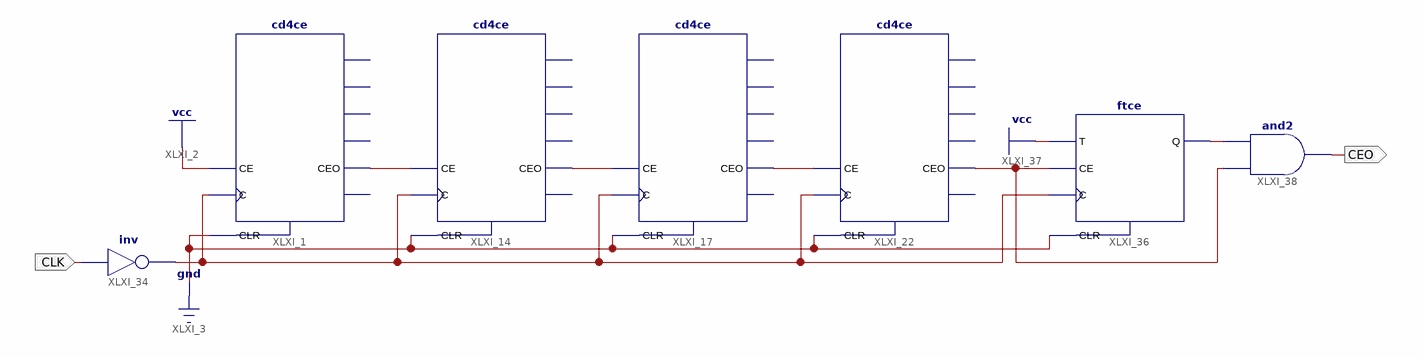
[diagram p0: schematic sheet 1]
// Xilinx ISE schematic clkdiv20k.sch (spartan6) as structural Verilog: 7 symbols, 2 ports
module clkdiv20k (
  input  CLK,
  output CEO
);

  wire CLK_I, XLXN_14, XLXN_27, XLXN_37, XLXN_45, XLXN_50;

  cd4ce XLXI_1 (.C(CLK_I), .CE(1'b1), .CLR(1'b0), .CEO(XLXN_14));  // open: Q0, Q1, Q2, Q3, TC
  cd4ce XLXI_14 (.C(CLK_I), .CE(XLXN_14), .CLR(1'b0), .CEO(XLXN_27));  // open: Q0, Q1, Q2, Q3, TC
  cd4ce XLXI_17 (.C(CLK_I), .CE(XLXN_27), .CLR(1'b0), .CEO(XLXN_37));  // open: Q0, Q1, Q2, Q3, TC
  cd4ce XLXI_22 (.C(CLK_I), .CE(XLXN_37), .CLR(1'b0), .CEO(XLXN_45));  // open: Q0, Q1, Q2, Q3, TC
  not XLXI_34 (CLK_I, CLK);
  ftce XLXI_36 (.C(CLK_I), .CE(XLXN_45), .CLR(1'b0), .T(1'b1), .Q(XLXN_50));
  and XLXI_38 (CEO, XLXN_45, XLXN_50);
endmodule
